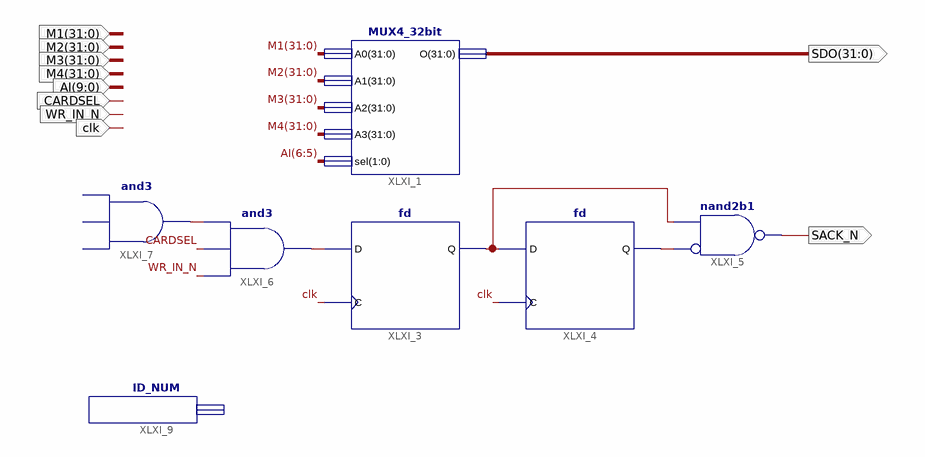
[diagram p0: schematic sheet 1]
// Xilinx ISE schematic slave.sch (spartan6) as structural Verilog: 7 symbols, 10 ports
module slave (
  input  [31:0] M1,
  input  [31:0] M2,
  input  [31:0] M3,
  input  [31:0] M4,
  input  [9:0] AI,
  input  CARDSEL,
  input  WR_IN_N,
  input  clk,
  output [31:0] SDO,
  output SACK_N
);

  wire XLXN_25, XLXN_26, XLXN_30, XLXN_31;

  MUX4_32bit XLXI_1 (.A0(M1), .A1(M2), .A2(M3), .A3(M4), .sel(AI[6:5]), .O(SDO));
  fd XLXI_3 (.C(clk), .D(XLXN_30), .Q(XLXN_25));
  fd XLXI_4 (.C(clk), .D(XLXN_25), .Q(XLXN_26));
  nand XLXI_5 (SACK_N, ~XLXN_26, XLXN_25);  // nand2b1
  and XLXI_6 (XLXN_30, WR_IN_N, CARDSEL, XLXN_31);
  // and3 XLXI_7 has open pins: I0=open, I1=open, I2=open, O=XLXN_31
  ID_NUM XLXI_9 ();  // open: ID
endmodule
